# EAGLE design HydroCapSense (EAGLE 9.6.0)
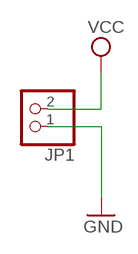
[diagram p0: schematic, sheet 1]

## Parts
JP1  PINHD-1X2  [1X02]

## Nets
GND: JP1.1
VCC: JP1.2

## Library data of the parts
JP1 = pinhead:PINHD-1X2: PIN HEADER

## Board
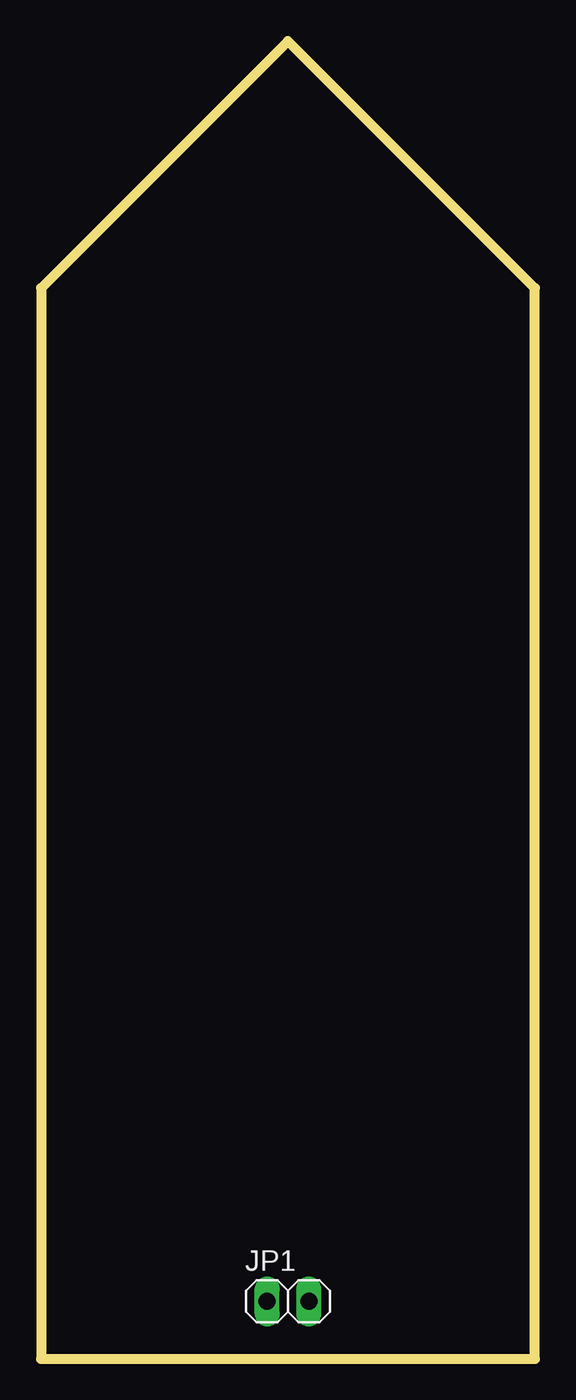
[diagram p1: board, top side]
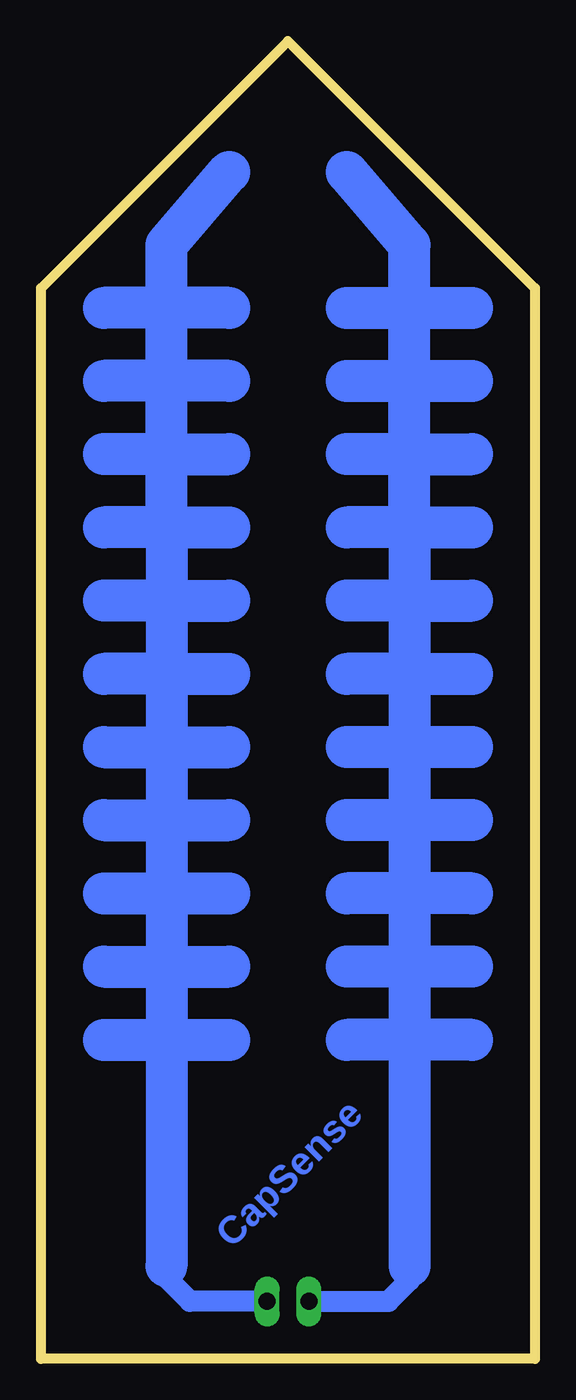
[diagram p2: board, bottom side, seen from below]

Size 30 x 80 mm. Coordinates in mm from the lower left corner, seen from the top.
Outline: 0,0 30,0 30,65 15,80 0,65 0,0
Copper layers (1*16): Top 0.035mm / dielectric 1.5mm / Bottom 0.035mm
Design rules "default": minimum track width 6mil, minimum drill 0.35mm, track to track 6mil, track to pad 6mil, pad to pad 6mil, via to via 6mil, smd to smd 6mil, copper to edge 40mil, drill to drill 6mil, minimum pad ring 10mil, minimum via ring 8mil, stop-mask expansion 4mil, vias tented up to drill 0mil, thermal gap 10mil

### Footprints (pad centres in the part's own frame; a part is rotated, then mirrored left to right if it is on the bottom)
1X02 = drill 1.016 long: 1 -1.27,0; 2 1.27,0

### Placement (x,y rotation side)
JP1  15,3.49 0 top

### Tracks (layer width: path | path; a pad name or v marks a point on that pad's centre or on a via)
GND
  Bottom 1.27: 7.62,5.64 7.62,4.76 8.89,3.49 JP1.1
  Bottom 2.54: 7.62,41.59 7.62,37.14 | 7.62,37.14 7.62,32.7 | 7.62,32.7 7.62,28.26 | 7.62,28.26 7.62,23.81 | 7.62,23.81 7.62,19.37 | 7.62,19.37 7.62,5.64 | 7.62,46.03 7.62,41.59 | 7.62,50.48 7.62,46.03 | 7.62,50.48 7.62,54.92 | 7.62,54.92 7.62,59.37 | 7.62,59.37 7.62,63.81 | 7.62,63.81 3.81,63.81 | 11.43,63.81 7.62,63.81 | 11.43,59.37 7.62,59.37 | 7.62,59.37 3.81,59.37 | 7.62,54.92 3.81,54.92 | 7.62,54.92 11.43,54.92 | 7.62,50.48 11.43,50.48 | 7.62,50.48 3.81,50.48 | 7.62,46.03 11.43,46.03 | 7.62,46.03 3.81,46.03 | 7.62,41.59 3.81,41.59 | 7.62,41.59 11.43,41.59 | 7.62,63.81 7.62,67.62 11.43,72.07 | 7.62,37.14 11.43,37.14 | 3.81,37.14 7.62,37.14 | 7.62,32.7 11.43,32.7 | 7.62,28.26 11.43,28.26 | 7.62,23.81 11.43,23.81 | 7.62,19.37 11.43,19.37 | 3.81,32.7 7.62,32.7 | 3.81,28.26 7.62,28.26 | 3.81,23.81 7.62,23.81 | 3.81,19.37 7.62,19.37
VCC
  Bottom 1.27: 22.38,5.64 22.38,4.92 20.95,3.49 JP1.2
  Bottom 2.54: 22.38,41.59 22.38,37.14 | 22.38,37.14 22.38,32.7 | 22.38,32.7 22.38,28.26 | 22.38,28.26 22.38,23.81 | 22.38,23.81 22.38,19.37 | 22.38,19.37 22.38,5.64 | 22.38,46.03 22.38,41.59 | 22.38,50.48 22.38,46.03 | 22.38,50.48 22.38,54.92 | 22.38,54.92 22.38,59.37 | 22.38,59.37 22.38,63.81 | 18.57,63.81 22.38,63.81 | 22.38,63.81 26.19,63.81 | 18.57,59.37 22.38,59.37 | 22.38,59.37 26.19,59.37 | 22.38,54.92 18.57,54.92 | 22.38,54.92 26.19,54.92 | 22.38,50.48 18.57,50.48 | 22.38,50.48 26.19,50.48 | 22.38,46.03 18.57,46.03 | 22.38,46.03 26.19,46.03 | 22.38,41.59 18.57,41.59 | 22.38,41.59 26.19,41.59 | 22.38,63.81 22.38,67.62 18.57,72.07 | 22.38,37.14 18.57,37.14 | 26.19,37.14 22.38,37.14 | 22.38,32.7 18.57,32.7 | 22.38,28.26 18.57,28.26 | 22.38,23.81 18.57,23.81 | 22.38,19.37 18.57,19.37 | 26.19,32.7 22.38,32.7 | 26.19,28.26 22.38,28.26 | 26.19,23.81 22.38,23.81 | 26.19,19.37 22.38,19.37

### Text on the board
Bottom: CapSense